# Altium schematic sheet GPIO Expander.SchDoc
size A4; SheetNumber: 7; SheetTotal: 7
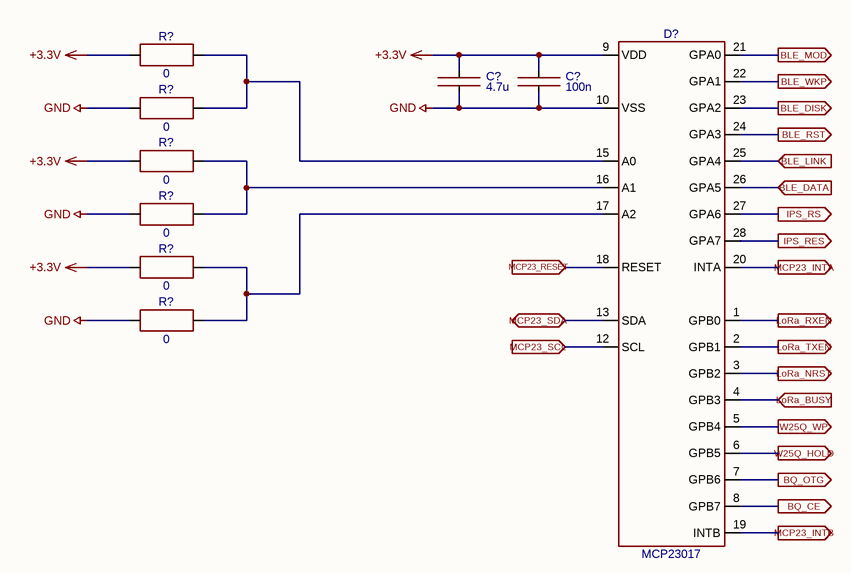
[diagram p0: GPIO Expander.SchDoc]

## Parts
(Parts that share a designator on the sheet are numbered #1, #2 ... from top to bottom, then left to right.)
C?#1  4.7u  [CAPC1608X09N]
C?#2  100n  [CAPC1608X09N]
D?  MCP23017  [MICRICHIP C04-52C]
R?#1  0  [RESC1608X05N]
R?#2  0  [RESC1608X05N]
R?#3  0  [RESC1608X05N]
R?#4  0  [RESC1608X05N]
R?#5  0  [RESC1608X05N]
R?#6  0  [RESC1608X05N]

## Ports
BLE_DATA (in), BLE_DISK (out), BLE_LINK (in), BLE_MOD (out), BLE_RST (out), BLE_WKP (out), BQ_CE (out), BQ_OTG (out), IPS_RES (out), IPS_RS (out), LoRa_BUSY (in), LoRa_NRST (out), LoRa_RXEN (out), LoRa_TXEN (out), MCP23_INTA (out), MCP23_INTB (out), MCP23_RESET (in), MCP23_SCL (in), MCP23_SDA (bidir), W25Q_HOLD (out), W25Q_WP (out)

## Nets
+3.3V: C?#1.2 C?#2.2 D?.9(VDD) R?#1.1 R?#3.1 R?#5.1
GND: C?#1.1 C?#2.1 D?.10(VSS) R?#2.1 R?#4.1 R?#6.1
BLE_DATA: D?.26(GPA5) ; port BLE_DATA
BLE_DISK: D?.23(GPA2) ; port BLE_DISK
BLE_LINK: D?.25(GPA4) ; port BLE_LINK
BLE_MOD: D?.21(GPA0) ; port BLE_MOD
BLE_RST: D?.24(GPA3) ; port BLE_RST
BLE_WKP: D?.22(GPA1) ; port BLE_WKP
BQ_CE: D?.8(GPB7) ; port BQ_CE
BQ_OTG: D?.7(GPB6) ; port BQ_OTG
IPS_RES: D?.28(GPA7) ; port IPS_RES
IPS_RS: D?.27(GPA6) ; port IPS_RS
LoRa_BUSY: D?.4(GPB3) ; port LoRa_BUSY
LoRa_NRST: D?.3(GPB2) ; port LoRa_NRST
LoRa_RXEN: D?.1(GPB0) ; port LoRa_RXEN
LoRa_TXEN: D?.2(GPB1) ; port LoRa_TXEN
MCP23_INTA: D?.20(INTA) ; port MCP23_INTA
MCP23_INTB: D?.19(INTB) ; port MCP23_INTB
MCP23_RESET: D?.18(RESET) ; port MCP23_RESET
MCP23_SCL: D?.12(SCL) ; port MCP23_SCL
MCP23_SDA: D?.13(SDA) ; port MCP23_SDA
W25Q_HOLD: D?.6(GPB5) ; port W25Q_HOLD
W25Q_WP: D?.5(GPB4) ; port W25Q_WP
NetD?_15: D?.15(A0) R?#1.2 R?#2.2
NetD?_16: D?.16(A1) R?#3.2 R?#4.2
NetD?_17: D?.17(A2) R?#5.2 R?#6.2

## Library data of the parts
C?#1 = C0603-4.7u-10V-X5R-10%: GRM188R61A475K
C?#2 = C0603-100n-25V-X7R-10%: GRM188R71E104KA01D
D? = MCP23017-E/SO
R?#1-R?#6 = R-0603-0